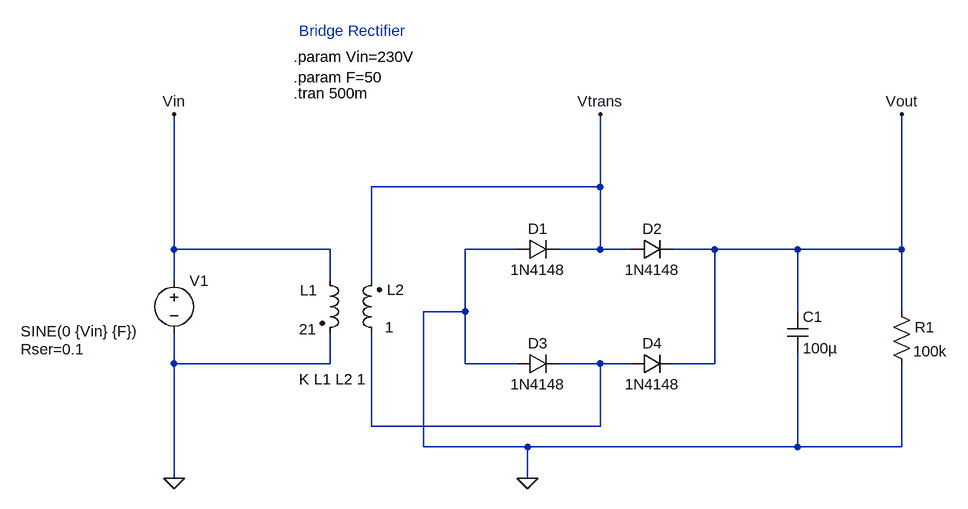
[diagram p0: schematic bridge_rectifier.asc]
bridge_rectifier.asc, the LTspice schematic file:
Version 4
SHEET 1 1456 680
WIRE 864 -112 864 -224
WIRE 864 -112 512 -112
WIRE 208 -16 208 -224
WIRE 448 -16 208 -16
WIRE 736 -16 656 -16
WIRE 864 -16 864 -112
WIRE 864 -16 800 -16
WIRE 912 -16 864 -16
WIRE 1040 -16 976 -16
WIRE 1168 -16 1040 -16
WIRE 1328 -16 1328 -224
WIRE 1328 -16 1168 -16
WIRE 208 32 208 -16
WIRE 448 32 448 -16
WIRE 512 32 512 -112
WIRE 656 80 656 -16
WIRE 656 80 592 80
WIRE 1168 80 1168 -16
WIRE 1328 80 1328 -16
WIRE 208 160 208 112
WIRE 448 160 448 112
WIRE 448 160 208 160
WIRE 656 160 656 80
WIRE 736 160 656 160
WIRE 864 160 800 160
WIRE 912 160 864 160
WIRE 1040 160 1040 -16
WIRE 1040 160 976 160
WIRE 512 256 512 112
WIRE 864 256 864 160
WIRE 864 256 512 256
WIRE 592 288 592 80
WIRE 752 288 592 288
WIRE 1168 288 1168 144
WIRE 1168 288 752 288
WIRE 1328 288 1328 160
WIRE 1328 288 1168 288
WIRE 208 336 208 160
WIRE 752 336 752 288
FLAG 208 336 0
FLAG 752 336 0
FLAG 208 -224 Vin
FLAG 1328 -224 Vout
FLAG 864 -224 Vtrans
SYMBOL voltage 208 16 R0
WINDOW 3 -236 94 Left 2
WINDOW 123 0 0 Left 0
WINDOW 39 -236 122 Left 2
SYMATTR InstName V1
SYMATTR Value SINE(0 {Vin} {F})
SYMATTR SpiceLine Rser=0.1
SYMBOL res 1312 64 R0
WINDOW 3 34 77 Left 2
SYMATTR InstName R1
SYMATTR Value 100k
SYMBOL ind2 432 16 R0
WINDOW 0 -30 31 Left 2
WINDOW 3 -32 91 Left 2
SYMATTR InstName L1
SYMATTR Value 21
SYMATTR Type ind
SYMBOL ind2 528 128 R180
WINDOW 0 -35 82 Left 2
WINDOW 3 -18 24 Left 2
SYMATTR InstName L2
SYMATTR Value 1
SYMATTR Type ind
SYMBOL diode 736 0 R270
WINDOW 0 32 32 VTop 2
WINDOW 3 0 32 VBottom 2
SYMATTR InstName D1
SYMATTR Value 1N4148
SYMBOL diode 912 0 R270
WINDOW 0 32 32 VTop 2
WINDOW 3 0 32 VBottom 2
SYMATTR InstName D2
SYMATTR Value 1N4148
SYMBOL diode 736 176 R270
WINDOW 0 32 32 VTop 2
WINDOW 3 0 32 VBottom 2
SYMATTR InstName D3
SYMATTR Value 1N4148
SYMBOL diode 912 176 R270
WINDOW 0 32 32 VTop 2
WINDOW 3 0 32 VBottom 2
SYMATTR InstName D4
SYMATTR Value 1N4148
SYMBOL cap 1152 80 R0
SYMATTR InstName C1
SYMATTR Value 100µ
TEXT 392 -312 Left 2 !.param Vin=230V\n.param F=50
TEXT 400 -352 Left 2 ;Bridge Rectifier
TEXT 400 184 Left 2 !K L1 L2 1
TEXT 392 -256 Left 2 !.tran 500m

The netlist it stands for:
* bridge_rectifier.asc
V1 Vin 0 SINE(0 {Vin} {F}) Rser=0.1
R1 Vout 0 100k
L1 Vin 0 21
L2 N001 Vtrans 1
D1 0 Vtrans 1N4148
D2 Vtrans Vout 1N4148
D3 0 N001 1N4148
D4 N001 Vout 1N4148
C1 Vout 0 100µ
.model D D
.lib standard.dio
.param Vin=230V
.param F=50
* Bridge Rectifier
K L1 L2 1
.tran 500m
.backanno
.end